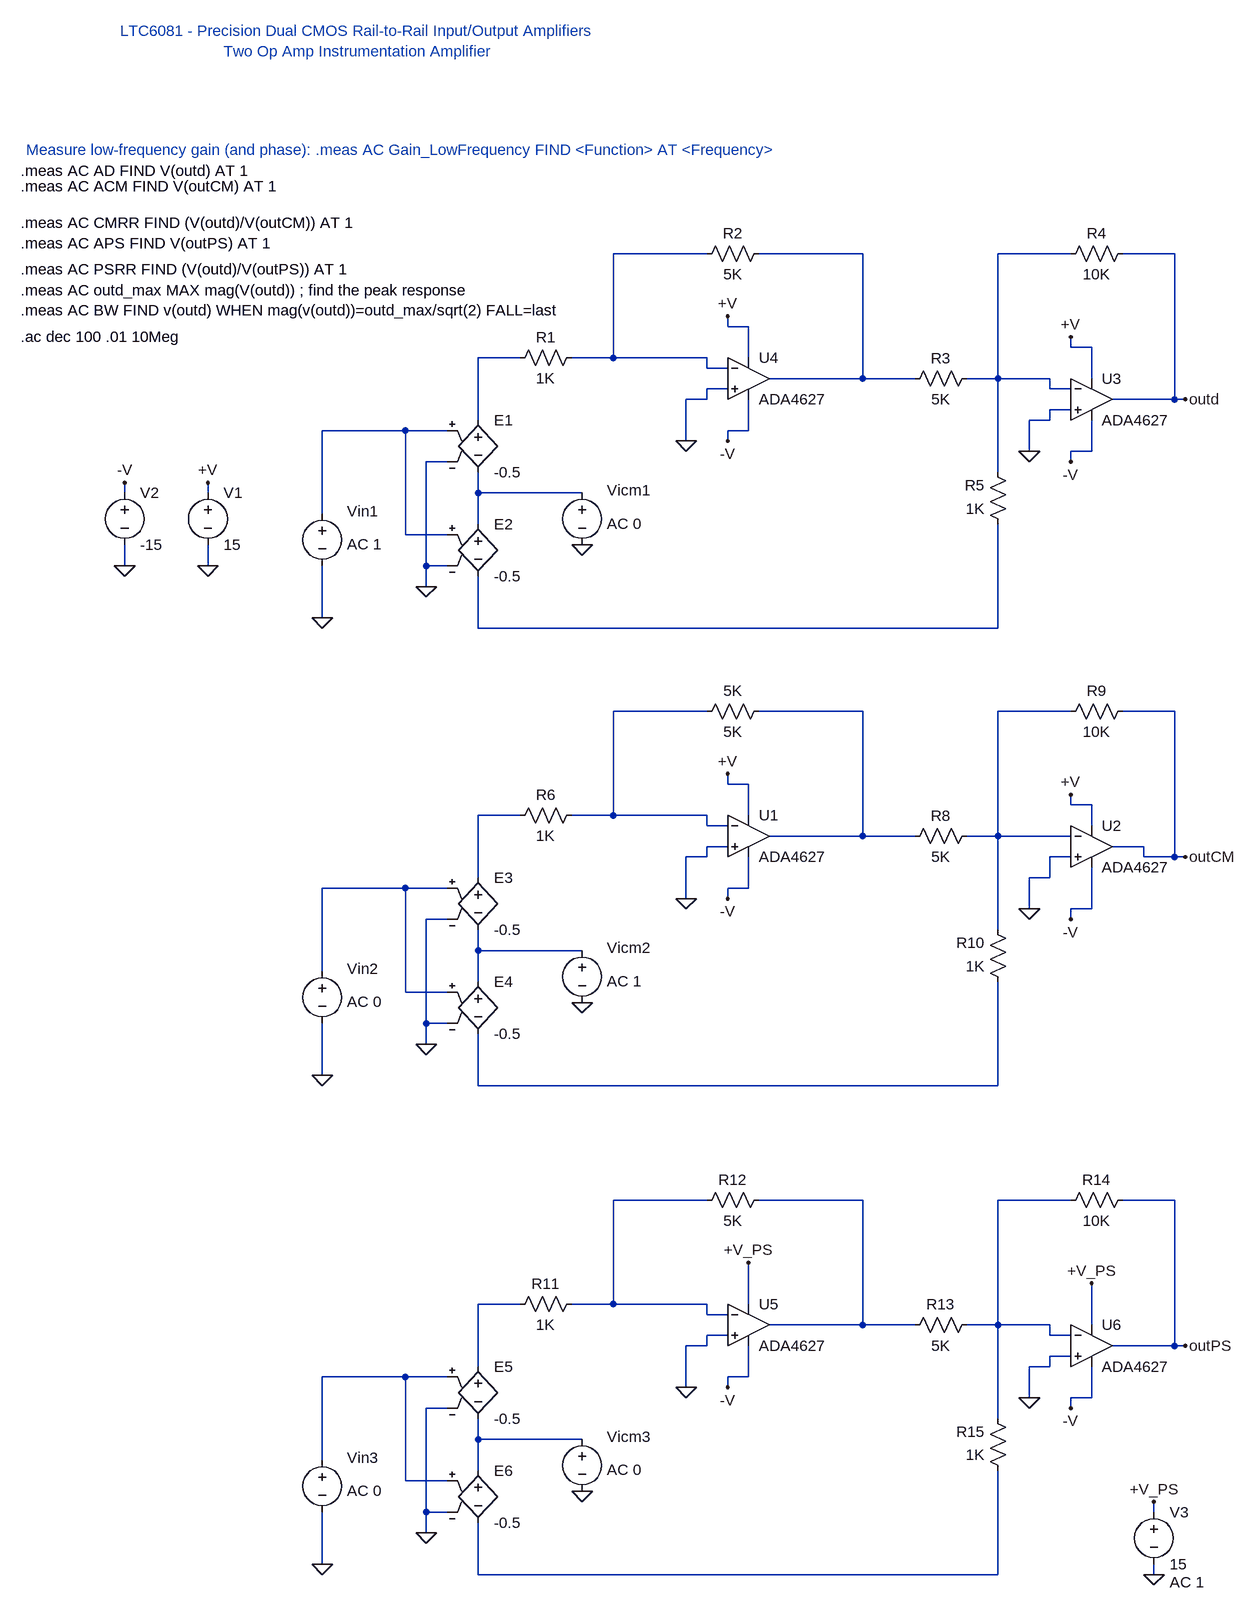
[diagram p0: schematic Etaj1-Laborator AC.asc]
Etaj1-Laborator AC.asc, the LTspice schematic file:
Version 4
SHEET 1 1248 2108
WIRE 96 48 -48 48
WIRE 336 48 176 48
WIRE 656 48 544 48
WIRE 816 48 736 48
WIRE 128 160 128 144
WIRE 160 160 128 160
WIRE 656 192 656 176
WIRE 688 192 656 192
WIRE -192 208 -256 208
WIRE -48 208 -48 48
WIRE -48 208 -112 208
WIRE 96 208 -48 208
WIRE 160 208 160 160
WIRE 96 224 96 208
WIRE 128 224 96 224
WIRE 336 240 336 48
WIRE 336 240 192 240
WIRE 416 240 336 240
WIRE 544 240 544 48
WIRE 544 240 496 240
WIRE 624 240 544 240
WIRE 688 240 688 192
WIRE 128 256 96 256
WIRE 624 256 624 240
WIRE 656 256 624 256
WIRE 96 272 96 256
WIRE 96 272 64 272
WIRE 816 272 816 48
WIRE 816 272 720 272
WIRE 832 272 816 272
WIRE 656 288 624 288
WIRE -256 304 -256 208
WIRE 624 304 624 288
WIRE 624 304 592 304
WIRE -368 320 -496 320
WIRE -304 320 -368 320
WIRE 160 320 160 272
WIRE 160 320 128 320
WIRE 64 336 64 272
WIRE 128 336 128 320
WIRE 592 352 592 304
WIRE 688 352 688 304
WIRE 688 352 656 352
WIRE -304 368 -336 368
WIRE 656 368 656 352
WIRE 544 384 544 240
WIRE -800 416 -800 400
WIRE -672 416 -672 400
WIRE -256 416 -256 384
WIRE -96 416 -256 416
WIRE -496 448 -496 320
WIRE -256 464 -256 416
WIRE -368 480 -368 320
WIRE -304 480 -368 480
WIRE -800 528 -800 496
WIRE -672 528 -672 496
WIRE -336 528 -336 368
WIRE -304 528 -336 528
WIRE -336 560 -336 528
WIRE -496 608 -496 528
WIRE -256 624 -256 544
WIRE 544 624 544 464
WIRE 544 624 -256 624
WIRE 96 752 -48 752
WIRE 336 752 176 752
WIRE 656 752 544 752
WIRE 816 752 736 752
WIRE 128 864 128 848
WIRE 160 864 128 864
WIRE 656 896 656 880
WIRE 688 896 656 896
WIRE -192 912 -256 912
WIRE -48 912 -48 752
WIRE -48 912 -112 912
WIRE 96 912 -48 912
WIRE 160 912 160 864
WIRE 96 928 96 912
WIRE 128 928 96 928
WIRE 688 928 688 896
WIRE 336 944 336 752
WIRE 336 944 192 944
WIRE 416 944 336 944
WIRE 544 944 544 752
WIRE 544 944 496 944
WIRE 656 944 544 944
WIRE 128 960 96 960
WIRE 768 960 720 960
WIRE 96 976 96 960
WIRE 96 976 64 976
WIRE 656 976 624 976
WIRE 768 976 768 960
WIRE 816 976 816 752
WIRE 816 976 768 976
WIRE 832 976 816 976
WIRE -256 1008 -256 912
WIRE 624 1008 624 976
WIRE 624 1008 592 1008
WIRE -368 1024 -496 1024
WIRE -304 1024 -368 1024
WIRE 160 1024 160 976
WIRE 160 1024 128 1024
WIRE 64 1040 64 976
WIRE 128 1040 128 1024
WIRE 592 1056 592 1008
WIRE 688 1056 688 992
WIRE 688 1056 656 1056
WIRE -304 1072 -336 1072
WIRE 656 1072 656 1056
WIRE 544 1088 544 944
WIRE -256 1120 -256 1088
WIRE -96 1120 -256 1120
WIRE -496 1152 -496 1024
WIRE -256 1168 -256 1120
WIRE -368 1184 -368 1024
WIRE -304 1184 -368 1184
WIRE -336 1232 -336 1072
WIRE -304 1232 -336 1232
WIRE -336 1264 -336 1232
WIRE -496 1312 -496 1232
WIRE -256 1328 -256 1248
WIRE 544 1328 544 1168
WIRE 544 1328 -256 1328
WIRE 96 1504 -48 1504
WIRE 336 1504 176 1504
WIRE 656 1504 544 1504
WIRE 816 1504 736 1504
WIRE -192 1664 -256 1664
WIRE -48 1664 -48 1504
WIRE -48 1664 -112 1664
WIRE 96 1664 -48 1664
WIRE 160 1664 160 1600
WIRE 96 1680 96 1664
WIRE 128 1680 96 1680
WIRE 336 1696 336 1504
WIRE 336 1696 192 1696
WIRE 416 1696 336 1696
WIRE 544 1696 544 1504
WIRE 544 1696 496 1696
WIRE 624 1696 544 1696
WIRE 688 1696 688 1632
WIRE 128 1712 96 1712
WIRE 624 1712 624 1696
WIRE 656 1712 624 1712
WIRE 96 1728 96 1712
WIRE 96 1728 64 1728
WIRE 816 1728 816 1504
WIRE 816 1728 720 1728
WIRE 832 1728 816 1728
WIRE 656 1744 624 1744
WIRE -256 1760 -256 1664
WIRE 624 1760 624 1744
WIRE 624 1760 592 1760
WIRE -368 1776 -496 1776
WIRE -304 1776 -368 1776
WIRE 160 1776 160 1728
WIRE 160 1776 128 1776
WIRE 64 1792 64 1728
WIRE 128 1792 128 1776
WIRE 592 1808 592 1760
WIRE 688 1808 688 1760
WIRE 688 1808 656 1808
WIRE -304 1824 -336 1824
WIRE 656 1824 656 1808
WIRE 544 1840 544 1696
WIRE -256 1872 -256 1840
WIRE -96 1872 -256 1872
WIRE -496 1904 -496 1776
WIRE -256 1920 -256 1872
WIRE -368 1936 -368 1776
WIRE -304 1936 -368 1936
WIRE -336 1984 -336 1824
WIRE -304 1984 -336 1984
WIRE 784 1984 784 1968
WIRE -336 2016 -336 1984
WIRE -496 2064 -496 1984
WIRE -256 2080 -256 2000
WIRE 544 2080 544 1920
WIRE 544 2080 -256 2080
WIRE 784 2080 784 2064
FLAG -672 528 0
FLAG 128 144 +V
FLAG -672 400 +V
FLAG 128 336 -V
FLAG -800 528 0
FLAG -800 400 -V
FLAG 656 176 +V
FLAG 656 368 -V
FLAG 832 272 outd
FLAG 64 336 0
FLAG 592 352 0
FLAG -496 608 0
FLAG -336 560 0
FLAG -96 496 0
FLAG 128 848 +V
FLAG 128 1040 -V
FLAG 656 880 +V
FLAG 656 1072 -V
FLAG 832 976 outCM
FLAG 64 1040 0
FLAG 592 1056 0
FLAG -496 1312 0
FLAG -336 1264 0
FLAG -96 1200 0
FLAG 128 1792 -V
FLAG 656 1824 -V
FLAG 832 1728 outPS
FLAG 64 1792 0
FLAG 592 1808 0
FLAG -496 2064 0
FLAG -336 2016 0
FLAG -96 1952 0
FLAG 784 2080 0
FLAG 784 1968 +V_PS
FLAG 688 1632 +V_PS
FLAG 160 1600 +V_PS
SYMBOL voltage -672 400 R0
WINDOW 123 0 0 Left 2
WINDOW 39 0 0 Left 2
SYMATTR InstName V1
SYMATTR Value 15
SYMBOL voltage -800 400 R0
WINDOW 123 0 0 Left 2
WINDOW 39 0 0 Left 2
SYMATTR InstName V2
SYMATTR Value -15
SYMBOL res -96 192 R90
WINDOW 0 0 56 VBottom 2
WINDOW 3 32 56 VTop 2
SYMATTR InstName R1
SYMATTR Value 1K
SYMBOL res 192 32 R90
WINDOW 0 0 56 VBottom 2
WINDOW 3 32 56 VTop 2
SYMATTR InstName R2
SYMATTR Value 5K
SYMBOL res 512 224 R90
WINDOW 0 0 56 VBottom 2
WINDOW 3 32 56 VTop 2
SYMATTR InstName R3
SYMATTR Value 5K
SYMBOL res 752 32 R90
WINDOW 0 0 56 VBottom 2
WINDOW 3 32 56 VTop 2
SYMATTR InstName R4
SYMATTR Value 10K
SYMBOL res 560 480 R180
WINDOW 0 36 76 Left 2
WINDOW 3 36 40 Left 2
SYMATTR InstName R5
SYMATTR Value 1K
SYMBOL voltage -496 432 R0
WINDOW 123 38 63 Left 2
WINDOW 39 0 0 Left 2
WINDOW 0 38 12 Left 2
WINDOW 3 -188 38 Left 2
SYMATTR Value2 AC 1
SYMATTR InstName Vin1
SYMATTR Value ""
SYMBOL e -256 288 R0
SYMATTR InstName E1
SYMATTR Value -0.5
SYMBOL e -256 448 R0
SYMATTR InstName E2
SYMATTR Value -0.5
SYMBOL voltage -96 400 R0
WINDOW 123 38 63 Left 2
WINDOW 39 0 0 Left 2
WINDOW 0 38 12 Left 2
WINDOW 3 -188 38 Left 2
SYMATTR Value2 AC 0
SYMATTR InstName Vicm1
SYMATTR Value ""
SYMBOL res -96 896 R90
WINDOW 0 0 56 VBottom 2
WINDOW 3 32 56 VTop 2
SYMATTR InstName R6
SYMATTR Value 1K
SYMBOL res 192 736 R90
WINDOW 0 0 56 VBottom 2
WINDOW 3 32 56 VTop 2
SYMATTR InstName 5K
SYMATTR Value 5K
SYMBOL res 512 928 R90
WINDOW 0 0 56 VBottom 2
WINDOW 3 32 56 VTop 2
SYMATTR InstName R8
SYMATTR Value 5K
SYMBOL res 752 736 R90
WINDOW 0 0 56 VBottom 2
WINDOW 3 32 56 VTop 2
SYMATTR InstName R9
SYMATTR Value 10K
SYMBOL res 560 1184 R180
WINDOW 0 36 76 Left 2
WINDOW 3 36 40 Left 2
SYMATTR InstName R10
SYMATTR Value 1K
SYMBOL voltage -496 1136 R0
WINDOW 123 38 63 Left 2
WINDOW 39 0 0 Left 2
WINDOW 0 38 12 Left 2
WINDOW 3 -188 38 Left 2
SYMATTR Value2 AC 0
SYMATTR InstName Vin2
SYMATTR Value ""
SYMBOL e -256 992 R0
SYMATTR InstName E3
SYMATTR Value -0.5
SYMBOL e -256 1152 R0
SYMATTR InstName E4
SYMATTR Value -0.5
SYMBOL voltage -96 1104 R0
WINDOW 123 38 63 Left 2
WINDOW 39 0 0 Left 2
WINDOW 0 38 12 Left 2
WINDOW 3 -188 38 Left 2
SYMATTR Value2 AC 1
SYMATTR InstName Vicm2
SYMATTR Value ""
SYMBOL res -96 1648 R90
WINDOW 0 0 56 VBottom 2
WINDOW 3 32 56 VTop 2
SYMATTR InstName R11
SYMATTR Value 1K
SYMBOL res 192 1488 R90
WINDOW 0 0 56 VBottom 2
WINDOW 3 32 56 VTop 2
SYMATTR InstName R12
SYMATTR Value 5K
SYMBOL res 512 1680 R90
WINDOW 0 0 56 VBottom 2
WINDOW 3 32 56 VTop 2
SYMATTR InstName R13
SYMATTR Value 5K
SYMBOL res 752 1488 R90
WINDOW 0 0 56 VBottom 2
WINDOW 3 32 56 VTop 2
SYMATTR InstName R14
SYMATTR Value 10K
SYMBOL res 560 1936 R180
WINDOW 0 36 76 Left 2
WINDOW 3 36 40 Left 2
SYMATTR InstName R15
SYMATTR Value 1K
SYMBOL voltage -496 1888 R0
WINDOW 123 38 63 Left 2
WINDOW 39 0 0 Left 2
WINDOW 0 38 12 Left 2
WINDOW 3 -188 38 Left 2
SYMATTR Value2 AC 0
SYMATTR InstName Vin3
SYMATTR Value ""
SYMBOL e -256 1744 R0
SYMATTR InstName E5
SYMATTR Value -0.5
SYMBOL e -256 1904 R0
SYMATTR InstName E6
SYMATTR Value -0.5
SYMBOL voltage -96 1856 R0
WINDOW 123 38 63 Left 2
WINDOW 39 0 0 Left 2
WINDOW 0 38 12 Left 2
WINDOW 3 -188 38 Left 2
SYMATTR Value2 AC 0
SYMATTR InstName Vicm3
SYMATTR Value ""
SYMBOL voltage 784 1968 R0
WINDOW 123 24 124 Left 2
WINDOW 39 0 0 Left 2
SYMATTR Value2 AC 1
SYMATTR InstName V3
SYMATTR Value 15
SYMBOL OpAmps\\ADA4627 688 208 R0
SYMATTR InstName U3
SYMBOL OpAmps\\ADA4627 160 176 R0
SYMATTR InstName U4
SYMBOL OpAmps\\ADA4627 160 880 R0
SYMATTR InstName U1
SYMBOL OpAmps\\ADA4627 688 896 R0
SYMATTR InstName U2
SYMBOL OpAmps\\ADA4627 160 1632 R0
SYMATTR InstName U5
SYMBOL OpAmps\\ADA4627 688 1664 R0
SYMATTR InstName U6
TEXT -440 -248 Bottom 2 ;LTC6081 - Precision Dual CMOS Rail-to-Rail Input/Output Amplifiers\nTwo Op Amp Instrumentation Amplifier
TEXT -960 176 Left 2 !.ac dec 100 .01 10Meg
TEXT -960 -80 Left 2 !.meas AC AD FIND V(outd) AT 1
TEXT -952 -112 Left 2 ;Measure low-frequency gain (and phase): .meas AC Gain_LowFrequency FIND <Function> AT <Frequency>
TEXT -960 -56 Left 2 !.meas AC ACM FIND V(outCM) AT 1
TEXT -960 0 Left 2 !.meas AC CMRR FIND (V(outd)/V(outCM)) AT 1
TEXT -960 72 Left 2 !.meas AC PSRR FIND (V(outd)/V(outPS)) AT 1
TEXT -960 32 Left 2 !.meas AC APS FIND V(outPS) AT 1
TEXT -960 104 Left 2 !.meas AC outd_max MAX mag(V(outd)) ; find the peak response\n.meas AC BW FIND v(outd) WHEN mag(v(outd))=outd_max/sqrt(2) FALL=last

The netlist it stands for:
* Etaj1-Laborator AC.asc
V1 +V 0 15
V2 -V 0 -15
R1 N001 N004 1K
R2 N002 N001 5K
R3 N003 N002 5K
R4 outd N003 10K
R5 N007 N003 1K
Vin1 N005 0 AC 1
E1 N004 N006 N005 0 -0.5
E2 N006 N007 N005 0 -0.5
Vicm1 N006 0 AC 0
R6 N008 N011 1K
R§5K N009 N008 5K
R8 N010 N009 5K
R9 outCM N010 10K
R10 N014 N010 1K
Vin2 N012 0 AC 0
E3 N011 N013 N012 0 -0.5
E4 N013 N014 N012 0 -0.5
Vicm2 N013 0 AC 1
R11 N015 N018 1K
R12 N016 N015 5K
R13 N017 N016 5K
R14 outPS N017 10K
R15 N021 N017 1K
Vin3 N019 0 AC 0
E5 N018 N020 N019 0 -0.5
E6 N020 N021 N019 0 -0.5
Vicm3 N020 0 AC 0
V3 +V_PS 0 15 AC 1
XU3 0 N003 +V -V outd ADA4627  ; pins In+ In- V+ V- OUT
XU4 0 N001 +V -V N002 ADA4627  ; pins In+ In- V+ V- OUT
XU1 0 N008 +V -V N009 ADA4627  ; pins In+ In- V+ V- OUT
XU2 0 N010 +V -V outCM ADA4627  ; pins In+ In- V+ V- OUT
XU5 0 N015 +V_PS -V N016 ADA4627  ; pins In+ In- V+ V- OUT
XU6 0 N017 +V_PS -V outPS ADA4627  ; pins In+ In- V+ V- OUT
* LTC6081 - Precision Dual CMOS Rail-to-Rail Input/Output Amplifiers
* Two Op Amp Instrumentation Amplifier
.ac dec 100 .01 10Meg
.meas AC AD FIND V(outd) AT 1
* Measure low-frequency gain (and phase): .meas AC Gain_LowFrequency FIND <Function> AT <Frequency>
.meas AC ACM FIND V(outCM) AT 1
.meas AC CMRR FIND (V(outd)/V(outCM)) AT 1
.meas AC PSRR FIND (V(outd)/V(outPS)) AT 1
.meas AC APS FIND V(outPS) AT 1
.meas AC outd_max MAX mag(V(outd)) ; find the peak response
.meas AC BW FIND v(outd) WHEN mag(v(outd))=outd_max/sqrt(2) FALL=last
.backanno
.end